# EAGLE schematic L_H_ext_rgb (EAGLE 9.6.2)
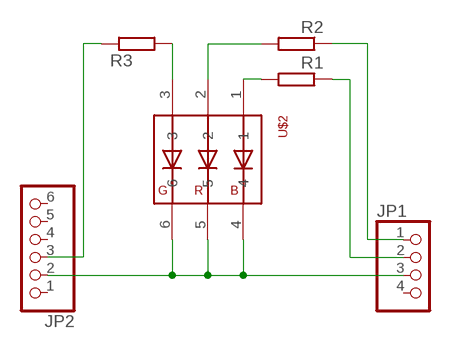
[diagram p0: schematic, sheet 1]

## Parts
JP1  PINHD-1X4  [1X04]
JP2  PINHD-1X6  [1X06]
R1  R-EU_R0603  [R0603]
R2  R-EU_R0603  [R0603]
R3  R-EU_R0603  [R0603]
U$2  RGB_WW-FCE50TC-Q1  [RGB_WW-FCE50TC-Q1]

## Nets
GND: JP1.3 JP2.2 U$2.4 U$2.5 U$2.6
N$1: R1.2 U$2.1
N$2: R3.2 U$2.3
N$3: R2.2 U$2.2
N$4: JP1.1 R2.1
N$5: JP1.2 R1.1
P4: JP2.3 R3.1
Unconnected: JP1.4 JP2.1 JP2.4 JP2.5 JP2.6

## Library data of the parts
JP1 = pinhead2:PINHD-1X4: PIN HEADER
JP2 = pinhead2:PINHD-1X6: PIN HEADER
R1-R3 = resistor:R-EU_: RESISTOR, European symbol
U$2 = !stavebnice03:RGB_WW-FCE50TC-Q1